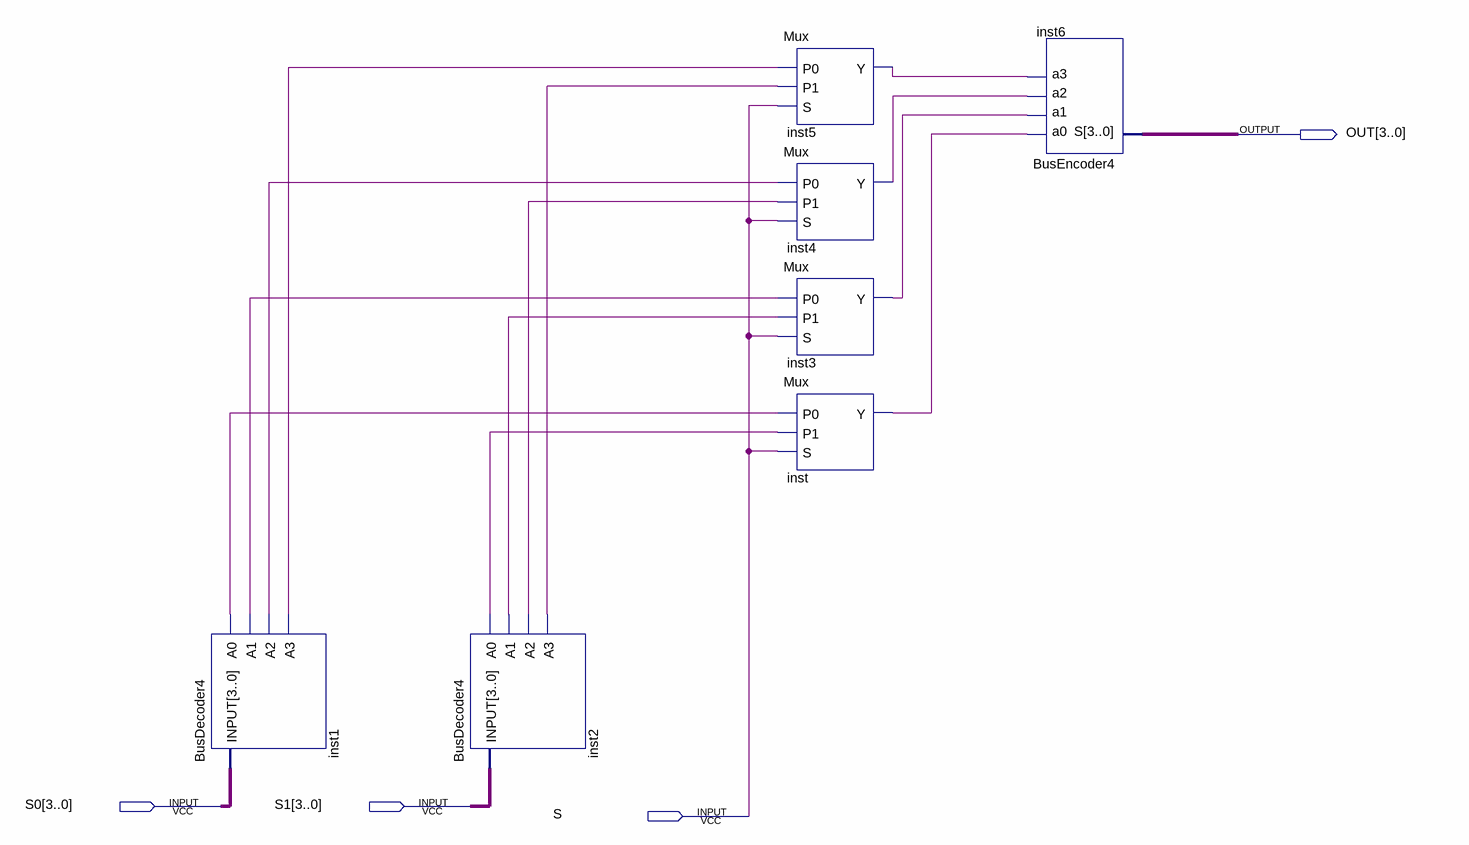
[diagram p0: schematic sheet]
// Quartus schematic Mux4.bdf as structural Verilog: 7 symbols, 4 pins
module Mux4 (
  input  [3:0] S0,
  input  [3:0] S1,
  input  S,
  output [3:0] OUT
);

  wire inst1_a0, inst1_a1, inst1_a2, inst1_a3, inst2_a0, inst2_a1, inst2_a2, inst2_a3, inst3_y, inst4_y,
       inst5_y, inst_y;

  BusDecoder4 inst1 (.INPUT(S0), .A0(inst1_a0), .A1(inst1_a1), .A2(inst1_a2), .A3(inst1_a3));
  BusDecoder4 inst2 (.INPUT(S1), .A0(inst2_a0), .A1(inst2_a1), .A2(inst2_a2), .A3(inst2_a3));
  Mux inst5 (.P0(inst1_a3), .P1(inst2_a3), .S(S), .Y(inst5_y));
  Mux inst4 (.P0(inst1_a2), .P1(inst2_a2), .S(S), .Y(inst4_y));
  Mux inst3 (.P0(inst1_a1), .P1(inst2_a1), .S(S), .Y(inst3_y));
  Mux inst (.P0(inst1_a0), .P1(inst2_a0), .S(S), .Y(inst_y));
  BusEncoder4 inst6 (.a0(inst_y), .a1(inst3_y), .a2(inst4_y), .a3(inst5_y), .S(OUT));
endmodule
